# EAGLE design ES-2144 LPF Module (EAGLE 9.6.2)
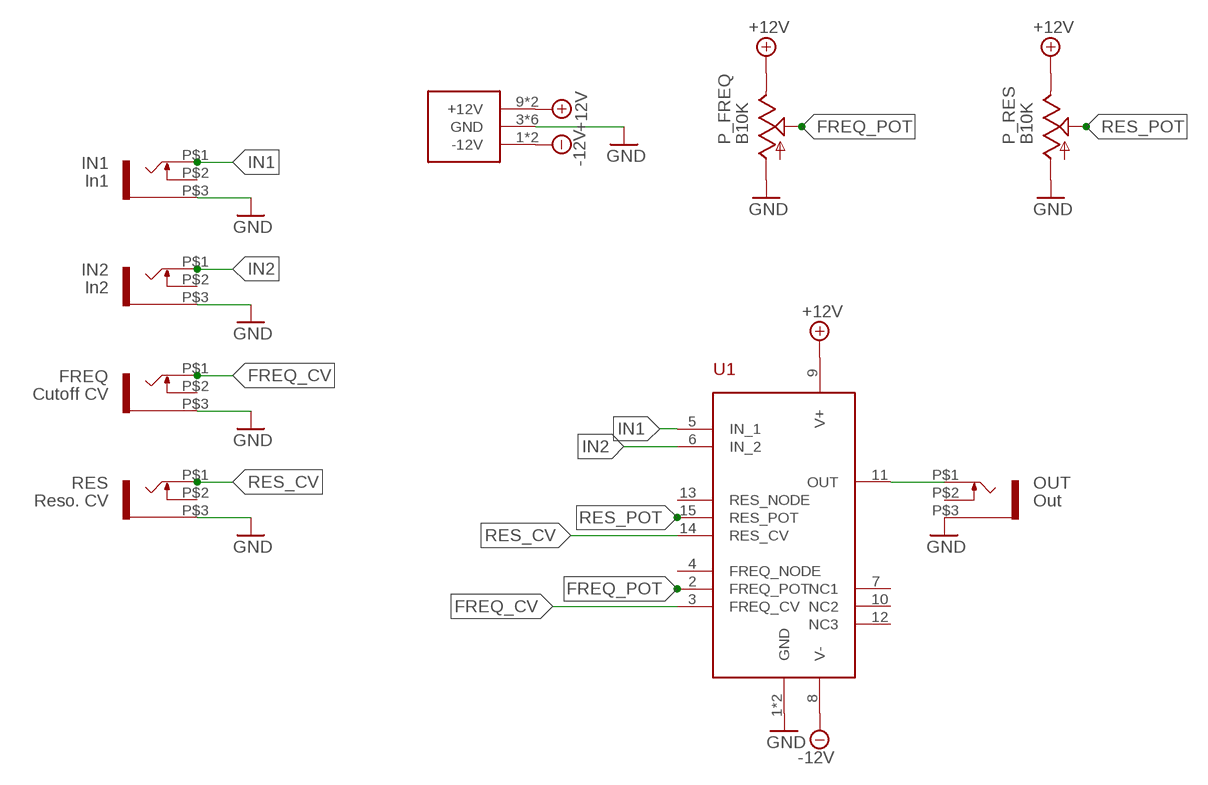
[diagram p0: schematic, sheet 1]

## Parts
FREQ  Cutoff CV  THONKICONN_WQP-PJ301M-12_JACK  [THONKICONN_WQP-PJ301M-12_JACK]
IN1  In1  THONKICONN_WQP-PJ301M-12_JACK  [THONKICONN_WQP-PJ301M-12_JACK]
IN2  In2  THONKICONN_WQP-PJ301M-12_JACK  [THONKICONN_WQP-PJ301M-12_JACK]
OUT  Out  THONKICONN_WQP-PJ301M-12_JACK  [THONKICONN_WQP-PJ301M-12_JACK]
P_FREQ  B10K  MUSICTHINGMODULAR_9MM_SNAP-IN_POT_  [MUSICTHINGMODULAR_9MM_SNAP-IN_POT]
P_RES  B10K  MUSICTHINGMODULAR_9MM_SNAP-IN_POT_  [MUSICTHINGMODULAR_9MM_SNAP-IN_POT]
RES  Reso. CV  THONKICONN_WQP-PJ301M-12_JACK  [THONKICONN_WQP-PJ301M-12_JACK]
U1  ES_2144_V2  [ES_2144_V2]
U$1  POWER_SIMPLE10  [POWER_10]

## Nets
+12V: P_FREQ.3(E) P_RES.3(E) U1.9(V+) U$1.9(+12V) U$1.10(+12V)
-12V: U1.8(V-) U$1.1(-12V) U$1.2(-12V)
FREQ_CV: FREQ.P$1 U1.3(FREQ_CV)
FREQ_POT: P_FREQ.2(S) U1.2(FREQ_POT)
GND: FREQ.P$3 IN1.P$3 IN2.P$3 OUT.P$3 P_FREQ.1(A) P_RES.1(A) RES.P$3 U1.1(GND) U1.16(GND) U$1.3(GND) U$1.4(GND) U$1.5(GND) U$1.6(GND) U$1.7(GND) U$1.8(GND)
IN1: IN1.P$1 U1.5(IN_1)
IN2: IN2.P$1 U1.6(IN_2)
N$1: OUT.P$1 U1.11(OUT)
RES_CV: RES.P$1 U1.14(RES_CV)
RES_POT: P_RES.2(S) U1.15(RES_POT)
Unconnected: FREQ.P$2 IN1.P$2 IN2.P$2 OUT.P$2 RES.P$2 U1.4(FREQ_NODE) U1.7(NC1) U1.10(NC2) U1.12(NC3) U1.13(RES_NODE)

## Library data of the parts
FREQ IN1 IN2 OUT RES = ES-2144 LPF Module:THONKICONN_WQP-PJ301M-12_JACK
P_FREQ P_RES = ES-2144 LPF Module:MUSICTHINGMODULAR_9MM_SNAP-IN_POT: 9mm vertical snap-in pot, Alpha / Panasonic style
U1 = Electrosmith_Boards:ES_2144_V2: Designed for ES_2144_Rev_7
U$1 = russ_eurorack:POWER_SIMPLE

## Net classes
0 default: width 0.254 mm, clearance 0.5 mm

## Board
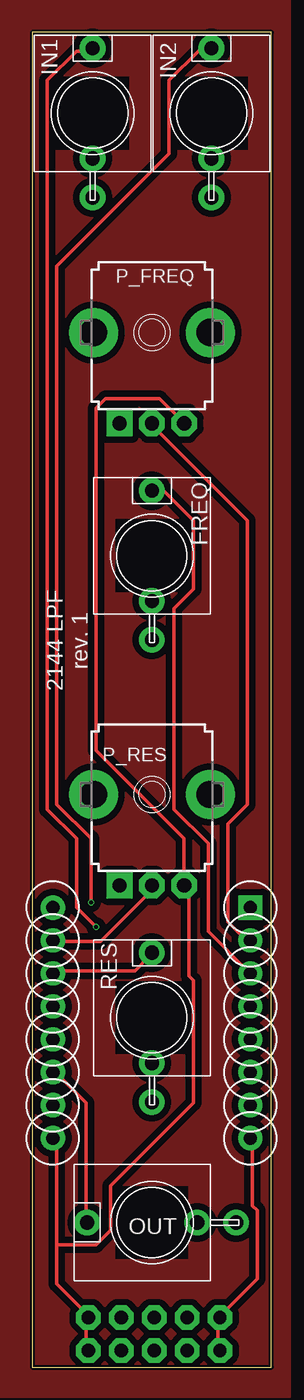
[diagram p1: board, top side]
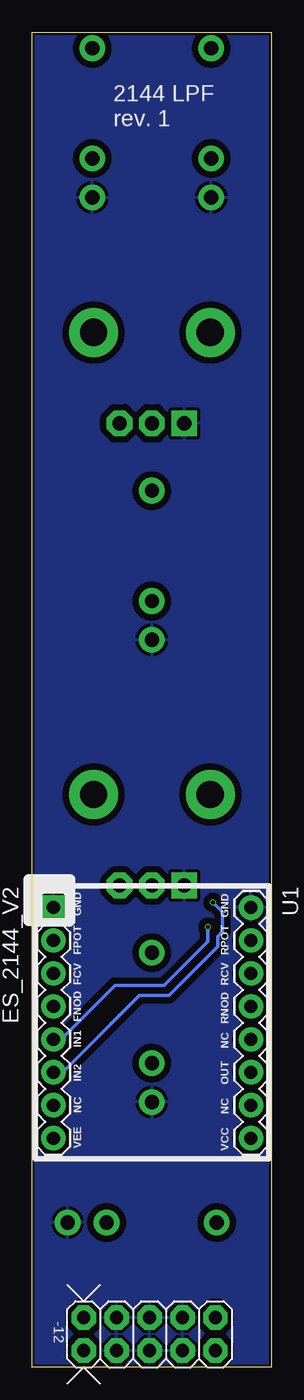
[diagram p2: board, bottom side, seen from below]

Size 18.44 x 102.84 mm. Coordinates in mm from the lower left corner, seen from the top.
Outline: 0,0 18.44,0 18.44,102.84 0,102.84 0,0
Copper layers (1*16): Top 0.035mm / dielectric 1.6mm / Bottom 0.035mm
Design rules "jlcpcb-2layers": minimum track width 5mil, minimum drill 0.3mm, track to track 5mil, track to pad 5mil, pad to pad 5mil, via to via 5mil, smd to smd 5mil, copper to edge 0.2mm, drill to drill 6mil, minimum pad ring 10mil, minimum via ring 3mil, stop-mask expansion 4mil, vias tented up to drill 0mil, thermal gap 10mil

### Footprints (pad centres in the part's own frame; a part is rotated, then mirrored left to right if it is on the bottom)
THONKICONN_WQP-PJ301M-12_JACK = drill 1.1: P$1 0,5; P$2 0,-3.5; P$3 0,-6.5
MUSICTHINGMODULAR_9MM_SNAP-IN_POT = drill 1.1 square: 1 -2.5,-7 | drill 1.1 octagon: 2 0,-7; 3 2.5,-7 | drill 2.1 pad 2.794: CHASSIS1 -4.5,0; CHASSIS2 4.5,0
ES_2144_V2 = drill 1.016 pad 1.88 square: 1 1.645,1.395 | drill 1.016 pad 1.88: 2 4.185,1.395; 3 6.725,1.395; 4 9.265,1.395; 5 11.805,1.395; 6 14.345,1.395; 7 16.885,1.395; 8 19.425,1.395; 9 19.425,16.635; 10 16.885,16.635; 11 14.345,16.635; 12 11.805,16.635; 13 9.265,16.635; 14 6.725,16.635; 15 4.185,16.635; 16 1.645,16.635
POWER_10 = drill 1.016 pad 1.88 octagon: 1 -5.08,-1.27; 2 -5.08,1.27; 3 -2.54,-1.27; 4 -2.54,1.27; 5 0,-1.27; 6 0,1.27; 7 2.54,-1.27; 8 2.54,1.27; 9 5.08,-1.27; 10 5.08,1.27

### Placement (x,y rotation side)
FREQ  9.22,62.53 0 top
IN1  4.65,96.62 0 top
IN2  13.82,96.62 0 top
OUT  9.22,11.14 90 top
P_FREQ  9.22,79.73 0 top
P_RES  9.22,44.12 0 top
RES  9.22,26.92 0 top
U1  18.21,37.06 270 bottom
U$1  9.4,2.54 0 bottom

### Tracks (layer width: path | path; a pad name or v marks a point on that pad's centre or on a via)
+12V
  Top 0.254: U$1.9 4.15,1.51 4.15,3.77 U$1.10 4.15,4.15 1.89,6.41 1.89,9.43 | 1.89,9.43 1.89,17.34 U1.9 | 1.89,9.43 4.9,9.43 6.03,10.56 6.03,13.95 12.44,20.36 12.44,29.78 12.06,30.16 12.06,36.95 P_RES.3 11.69,37.32 11.69,40.72 4.9,47.5 4.9,73.89 5.66,74.65 9.8,74.65 11.69,72.76 P_FREQ.3
-12V
  Top 0.254: U$1.1 14.33,1.51 14.33,3.77 U$1.2 14.7,4.15 17.34,6.79 17.34,12.06 16.96,12.44 16.96,17.34 U1.8
FREQ_CV
  Top 0.254: U1.3 16.59,30.54 13.57,33.55 13.57,40.34 10.93,42.98 10.93,58.44 12.44,59.94 12.44,65.22 10.18,67.48 9.43,67.48 FREQ.P$1
FREQ_POT
  Top 0.254: U1.2 16.59,33.18 16.21,33.18 15.08,34.31 15.08,41.85 16.59,43.35 16.59,65.22 9.43,72.38 P_FREQ.2
GND
  pour Bottom: -2.29,106.68 20.32,106.68 20.32,-2.54 -2.29,-2.54
GND1
  pour Top: -2.74,106.91 19.86,106.91 19.86,-2.31 -2.74,-2.31
IN1  (via drill 0.3)
  Top 0.254: v4.9,33.93 3.39,35.44 3.39,40.72 1.13,42.98 1.13,99.15 3.39,101.41 4.52,101.41 IN1.P$1
  Bottom 0.254: v4.9,33.93 4.9,32.8 8.29,29.41 12.06,29.41 16.21,25.26 16.59,25.26 U1.5
IN2  (via drill 0.3)
  Top 0.254: v4.52,35.81 4.52,40.72 1.89,43.35 1.89,84.83 10.56,93.5 10.56,99.15 12.82,101.41 13.57,101.41 IN2.P$1
  Bottom 0.254: v4.52,35.81 3.77,35.06 3.77,33.55 4.15,33.18 4.15,32.42 7.92,28.65 10.18,28.65 15.83,23 16.59,23 U1.6
N$1
  Top 0.254: U1.11 1.89,22.62 4.15,20.36 4.15,11.31 OUT.P$1
RES_CV
  Top 0.254: U1.14 1.89,30.54 7.92,30.54 9.05,31.67 RES.P$1
RES_POT
  Top 0.254: U1.15 1.89,32.8 5.28,32.8 9.43,36.95 P_RES.2

### Text on the board
tPlace: 2144 LPF / rev. 1
bPlace: 2144 LPF / rev. 1